# EAGLE schematic LDR (EAGLE 9.5.2)
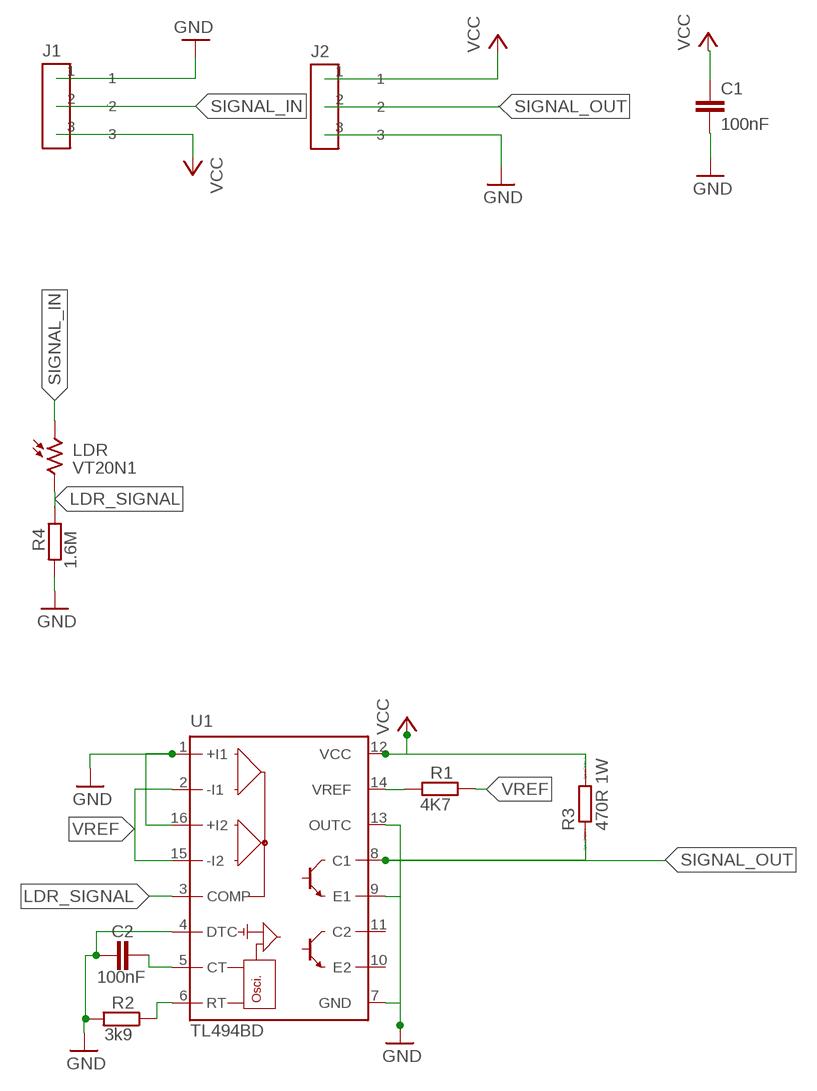
[diagram p0: schematic, sheet 1]

## Parts
C1  100nF  C-EUC0805  [C0805]
C2  100nF  C-EUC0805  [C0805]
J1  CONECTOR_MACHO  [3CONECTOR]
J2  CONECTOR_FEMEA  [3CONECTOR]
LDR  VT20N1  [TO46-VT200]
R1  4K7  R-EU_R0805W  [R0805W]
R2  3k9  R-EU_R0805W  [R0805W]
R3  470R 1W  RR2512  [R2512]
R4  1.6M  R-EU_R0805W  [R0805W]
U1  TL494BD  [SO16]

## Nets
GND: C1.2 C2.1 J1.1 J2.3 R2.2 R4.2 U1.1(+I1) U1.4(DTC) U1.7(GND) U1.9(E1) U1.13(OUTC) U1.16(+I2)
LDR_SIGNAL: LDR.2 R4.1 U1.3(COMP)
N$2: C2.2 U1.5(CT)
N$3: R1.2 U1.14(VREF)
N$4: R2.1 U1.6(RT)
SIGNAL_IN: J1.2 LDR.1
SIGNAL_OUT: J2.2 R3.1 U1.8(C1)
VCC: C1.1 J1.3 J2.1 R3.2 U1.12(VCC)
VREF: R1.1 U1.2(-I1) U1.15(-I2)
Unconnected: U1.10(E2) U1.11(C2)

## Library data of the parts
C1 C2 = rcl:C-EU: CAPACITOR, European symbol; SPICEPREFIX: C
J1 = Eletroblocks Lib:CONECTOR_MACHO
J2 = Eletroblocks Lib:CONECTOR_FEMEA
LDR = photo-elements:VT2*: Photoconductive Cell VT200 Series Source: http://optoelectronics.perkinelmer.com/content/Datasheets/DTS_vt200seriesdatasheet.pdf
R1 R2 R4 = rcl:R-EU_: RESISTOR, European symbol; SPICEPREFIX: R
R3 = eagle-ltspice:R: RESISTOR, European symbol; SPICEMODEL: NONE; SPICEPREFIX: R
U1 = linear:TL494*: SWITCHMODE Pulse Width Modulation Control Circuit NCV494B http://onsemi.com tl494-d.pdf